# Altium schematic sheet V6_2.schdoc
size A4
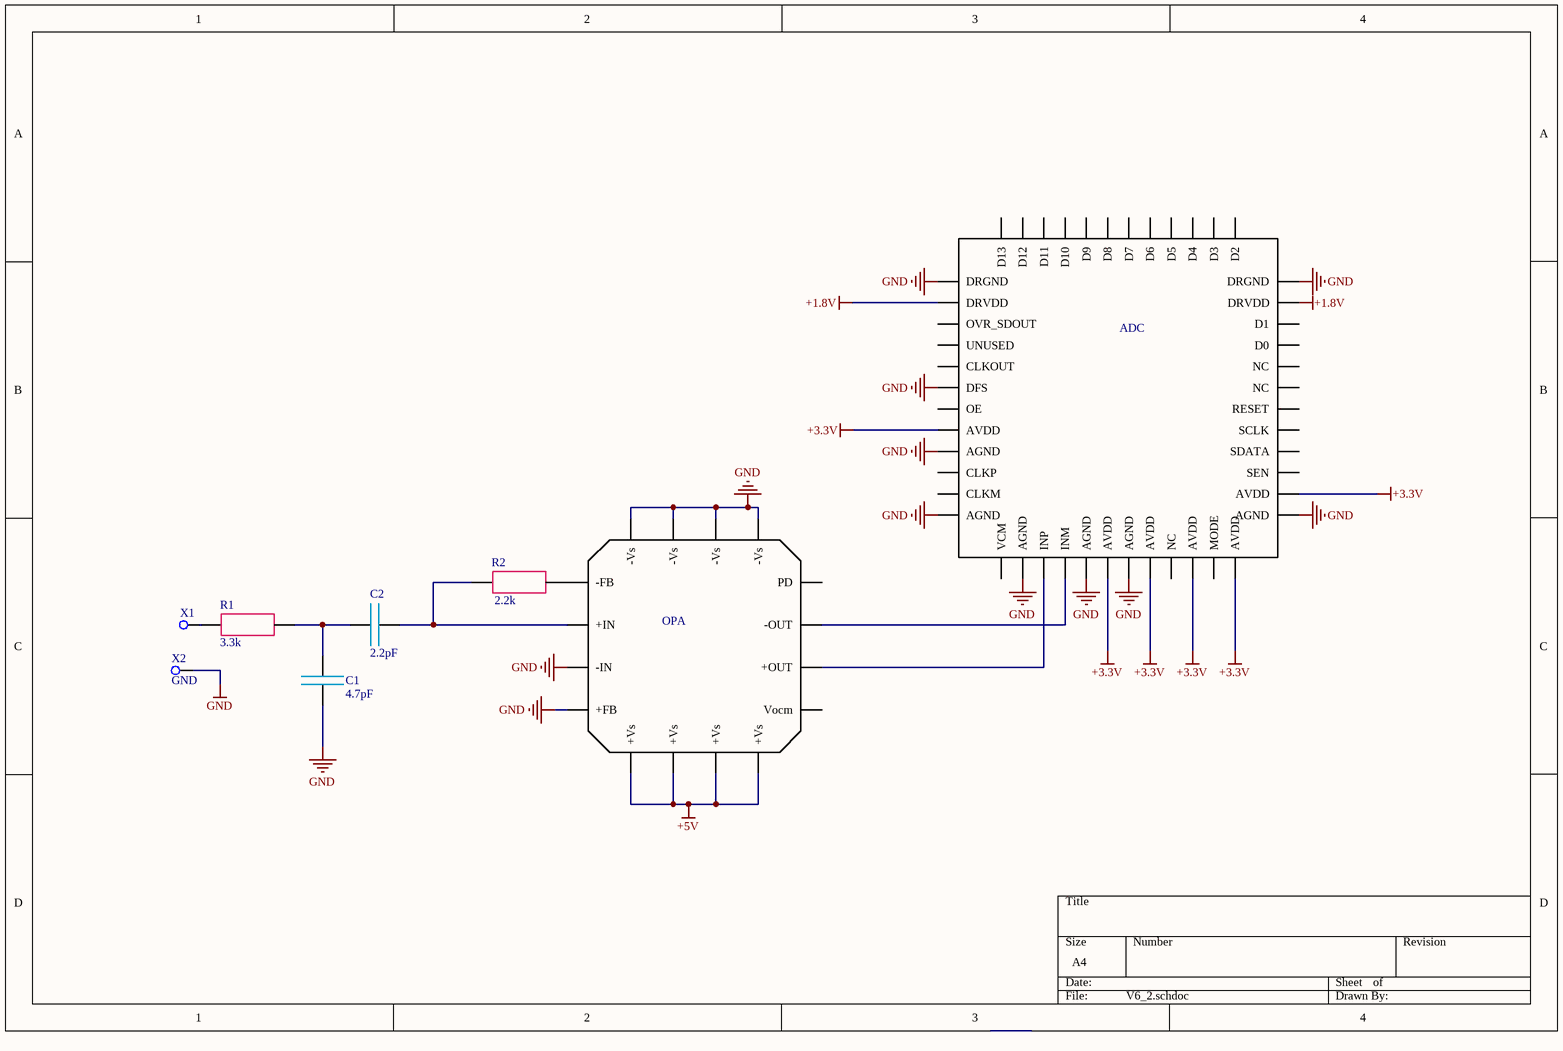
[diagram p0: V6_2.schdoc]

## Parts
ADC  ADS  [ADS]  (value not drawn)
C1  4.7pF  [con]
C2  2.2pF  [con]
OPA  OPA  [OPA]  (value not drawn)
R1  3.3k  [Rezistor]
R2  2.2k  [Rezistor]
X1  (no value)  [DRL10]
X2  GND  [DRL10]

## Nets
+1.8V: ADC.2(DRVDD) ADC.35(DRVDD)
+3.3V: ADC.8(AVDD) ADC.18(AVDD) ADC.20(AVDD) ADC.22(AVDD) ADC.24(AVDD) ADC.26(AVDD)
+5V: OPA.5(+Vs) OPA.6(+Vs) OPA.7(+Vs) OPA.8(+Vs)
GND: ADC.1(DRGND) ADC.6(DFS) ADC.9(AGND) ADC.12(AGND) ADC.14(AGND) ADC.17(AGND) ADC.19(AGND) ADC.25(AGND) ADC.36(DRGND) C1.1 OPA.3(-IN) OPA.4(+FB) OPA.13(-Vs) OPA.14(-Vs) OPA.15(-Vs) OPA.16(-Vs) X2.DRIL
NetADC_15: ADC.15(INP) OPA.10(+OUT)
NetADC_16: ADC.16(INM) OPA.11(-OUT)
NetC1_2: C1.2 C2.1 R1.2
NetC2_2: C2.2 OPA.2(+IN) R2.1
NetOPA_1: OPA.1(-FB) R2.2
NetR1_1: R1.1 X1.DRIL

Not connected (* = marked no-connect by the designer): ADC 3(OVR_SDOUT) 4(UNUSED) 5(CLKOUT) 7(OE) 10(CLKP) 11(CLKM) 13(VCM) 21(NC) 23(MODE) 27(SEN) 28(SDATA) 29(SCLK) 30(RESET) 31(NC) 32(NC) 33(D0) 34(D1) 37(D2) 38(D3) 39(D4) 40(D5) 41(D6) 42(D7) 43(D8) 44(D9) 45(D10) 46(D11) 47(D12) 48(D13); OPA 9(Vocm) 12(PD)

## Library data of the parts
C1 C2 = Condenser1
OPA = ADA
R1 R2 = Resistor1
X1 X2 = DRL